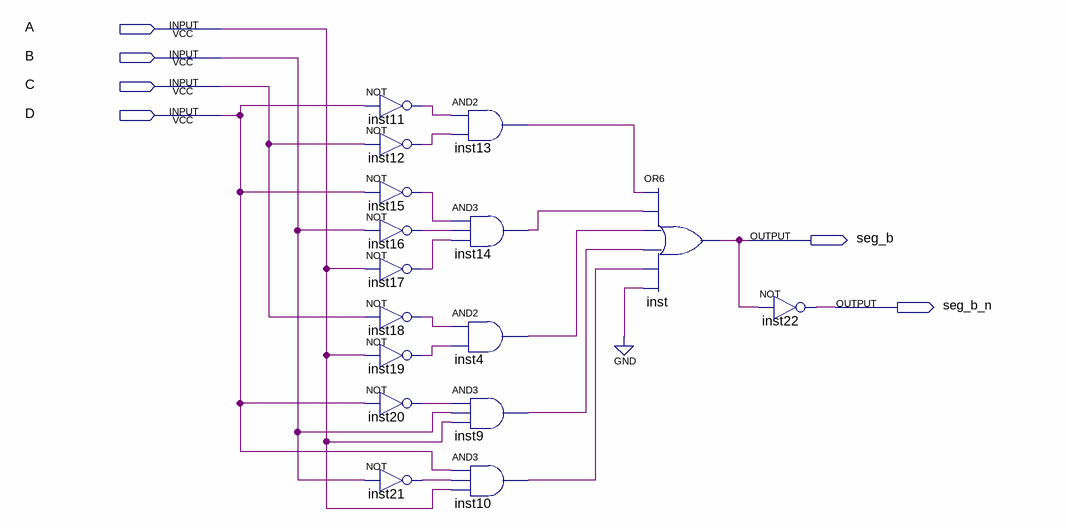
[diagram p0: schematic sheet]
// Quartus schematic segmento_b.bdf as structural Verilog: 16 symbols, 6 pins
module segmento_b (
  input  A,
  input  B,
  input  C,
  input  D,
  output seg_b,
  output seg_b_n
);

  wire inst4_out, inst9_out, inst10_out, inst11_out, inst12_out, inst13_out, inst14_out, inst15_out,
       inst16_out, inst17_out, inst18_out, inst19_out, inst20_out, inst21_out;

  not inst11 (inst11_out, D);
  not inst12 (inst12_out, C);
  not inst15 (inst15_out, D);
  not inst16 (inst16_out, B);
  not inst17 (inst17_out, A);
  not inst18 (inst18_out, C);
  not inst19 (inst19_out, A);
  not inst20 (inst20_out, D);
  not inst21 (inst21_out, B);
  and inst13 (inst13_out, inst11_out, inst12_out);
  and inst14 (inst14_out, inst15_out, inst16_out, inst17_out);
  and inst4 (inst4_out, inst18_out, inst19_out);
  and inst9 (inst9_out, inst20_out, B, A);
  and inst10 (inst10_out, D, inst21_out, A);
  or inst (seg_b, inst13_out, inst14_out, inst4_out, inst9_out, inst10_out, 1'b0);
  not inst22 (seg_b_n, seg_b);
endmodule
